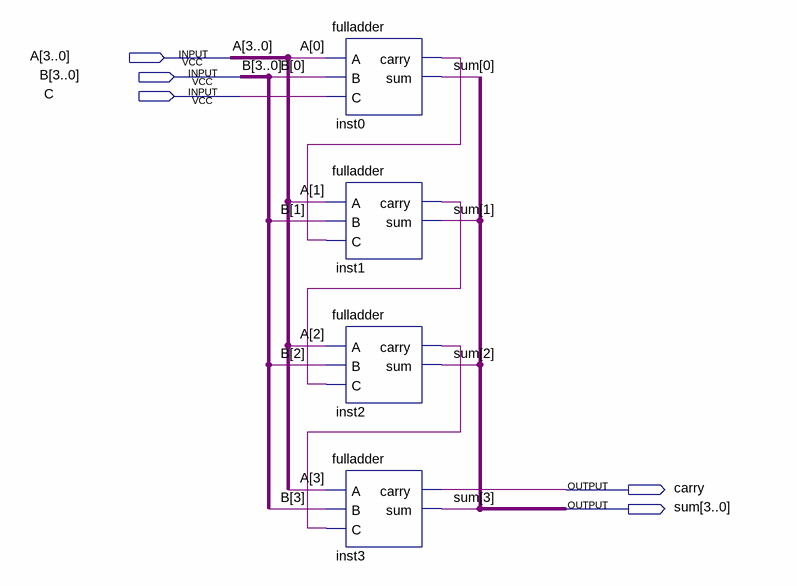
[diagram p0: schematic sheet]
// Quartus schematic adder_4bit.bdf as structural Verilog: 4 symbols, 5 pins
module adder_4bit (
  input  [3:0] A,
  input  [3:0] B,
  input  C,
  output carry,
  output [3:0] sum
);

  wire inst0_carry, inst1_carry, inst2_carry;

  fulladder inst0 (.A(A[0]), .B(B[0]), .C(C), .carry(inst0_carry), .sum(sum[0]));
  fulladder inst1 (.A(A[1]), .B(B[1]), .C(inst0_carry), .carry(inst1_carry), .sum(sum[1]));
  fulladder inst2 (.A(A[2]), .B(B[2]), .C(inst1_carry), .carry(inst2_carry), .sum(sum[2]));
  fulladder inst3 (.A(A[3]), .B(B[3]), .C(inst2_carry), .carry(carry), .sum(sum[3]));
endmodule
